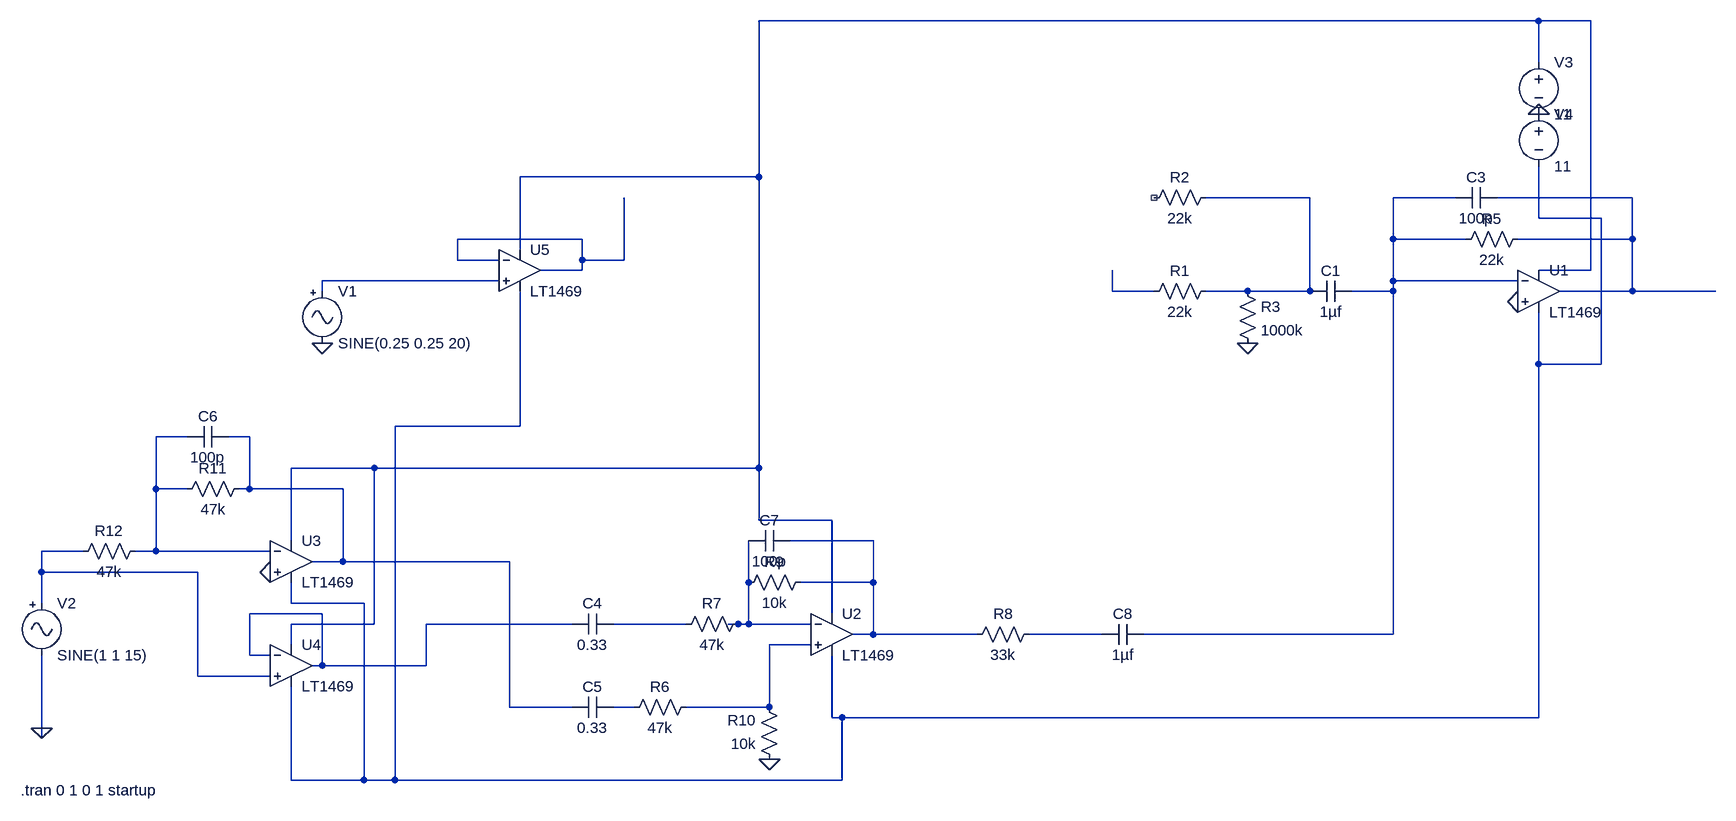
[diagram p0: schematic +++DIFF++++.asc]
+++DIFF++++.asc, the LTspice schematic file:
Version 4
SHEET 1 996 944
WIRE 720 -400 -480 -400
WIRE 800 -400 720 -400
WIRE 720 -336 720 -400
WIRE -480 -160 -480 -400
WIRE -480 -160 -848 -160
WIRE 368 -128 208 -128
WIRE 592 -128 496 -128
WIRE 864 -128 656 -128
WIRE 720 -96 720 -176
WIRE 816 -96 720 -96
WIRE -752 -64 -944 -64
WIRE 496 -64 496 -128
WIRE 608 -64 496 -64
WIRE 864 -64 864 -128
WIRE 864 -64 688 -64
WIRE -848 -48 -848 -160
WIRE -944 -32 -944 -64
WIRE -880 -32 -944 -32
WIRE -752 -32 -752 -64
WIRE -688 -32 -688 -128
WIRE -688 -32 -752 -32
WIRE -752 -16 -752 -32
WIRE -752 -16 -816 -16
WIRE 800 -16 800 -400
WIRE 800 -16 720 -16
WIRE -880 0 -1152 0
WIRE 496 0 496 -64
WIRE 688 0 496 0
WIRE -1152 16 -1152 0
WIRE 64 16 64 -16
WIRE 128 16 64 16
WIRE 272 16 208 16
WIRE 368 16 368 -128
WIRE 368 16 272 16
WIRE 496 16 496 0
WIRE 496 16 432 16
WIRE 864 16 864 -64
WIRE 864 16 752 16
WIRE 992 16 864 16
WIRE 720 128 720 48
WIRE 816 128 816 -96
WIRE 816 128 720 128
WIRE -848 224 -848 16
WIRE -848 224 -1040 224
WIRE -1360 240 -1408 240
WIRE -1264 240 -1296 240
WIRE -1072 288 -1200 288
WIRE -480 288 -480 -160
WIRE -480 288 -1072 288
WIRE -1408 320 -1408 240
WIRE -1360 320 -1408 320
WIRE -1264 320 -1264 240
WIRE -1264 320 -1280 320
WIRE -1120 320 -1264 320
WIRE -480 368 -480 288
WIRE -368 368 -480 368
WIRE -1200 400 -1200 288
WIRE -304 400 -432 400
WIRE -1520 416 -1584 416
WIRE -1408 416 -1408 320
WIRE -1408 416 -1440 416
WIRE -1232 416 -1408 416
WIRE -1120 432 -1120 320
WIRE -1120 432 -1168 432
WIRE -864 432 -1120 432
WIRE -1584 448 -1584 416
WIRE -1344 448 -1584 448
WIRE -496 464 -496 400
WIRE -304 464 -304 400
WIRE -304 464 -416 464
WIRE -1584 496 -1584 448
WIRE -1200 496 -1200 464
WIRE -1088 496 -1200 496
WIRE -1152 512 -1264 512
WIRE -368 512 -368 368
WIRE -1072 528 -1072 288
WIRE -1072 528 -1200 528
WIRE -768 528 -992 528
WIRE -592 528 -704 528
WIRE -512 528 -528 528
WIRE -496 528 -496 464
WIRE -496 528 -512 528
WIRE -400 528 -496 528
WIRE -304 544 -304 464
WIRE -304 544 -336 544
WIRE -144 544 -304 544
WIRE 48 544 -64 544
WIRE 496 544 496 16
WIRE 496 544 112 544
WIRE -1200 560 -1200 528
WIRE -400 560 -464 560
WIRE -1264 576 -1264 512
WIRE -1232 576 -1264 576
WIRE -1152 592 -1152 512
WIRE -1152 592 -1168 592
WIRE -992 592 -992 528
WIRE -992 592 -1152 592
WIRE -1344 608 -1344 448
WIRE -1232 608 -1344 608
WIRE -864 656 -864 432
WIRE -768 656 -864 656
WIRE -672 656 -704 656
WIRE -464 656 -464 560
WIRE -464 656 -592 656
WIRE -368 672 -368 576
WIRE -352 672 -368 672
WIRE 720 672 720 128
WIRE 720 672 -352 672
WIRE -1584 688 -1584 576
WIRE -1584 704 -1584 688
WIRE -1200 768 -1200 624
WIRE -1088 768 -1088 496
WIRE -1088 768 -1200 768
WIRE -1040 768 -1040 224
WIRE -1040 768 -1088 768
WIRE -352 768 -352 672
WIRE -352 768 -1040 768
FLAG 688 32 0
FLAG 720 -256 0
FLAG -1152 96 0
FLAG -464 736 0
FLAG -1584 688 0
FLAG -1232 448 0
FLAG 272 96 0
SYMBOL res 224 0 R90
WINDOW 0 0 56 VBottom 2
WINDOW 3 32 56 VTop 2
SYMATTR InstName R1
SYMATTR Value 22k
SYMBOL Misc\\signal -1152 0 R0
WINDOW 123 0 0 Left 0
WINDOW 39 0 0 Left 0
SYMATTR InstName V1
SYMATTR Value SINE(0.25 0.25 20)
SYMBOL Misc\\signal -1584 480 R0
WINDOW 123 0 0 Left 0
WINDOW 39 0 0 Left 0
SYMATTR InstName V2
SYMATTR Value SINE(1 1 15)
SYMBOL OpAmps\\LT1469 720 -48 R0
SYMATTR InstName U1
SYMBOL voltage 720 -352 R0
WINDOW 123 0 0 Left 0
WINDOW 39 0 0 Left 0
SYMATTR InstName V3
SYMATTR Value 11
SYMBOL voltage 720 -272 R0
WINDOW 123 0 0 Left 0
WINDOW 39 0 0 Left 0
SYMATTR InstName V4
SYMATTR Value 11
SYMBOL res 704 -80 R90
WINDOW 0 0 56 VBottom 2
WINDOW 3 32 56 VTop 2
SYMATTR InstName R5
SYMATTR Value 22k
SYMBOL cap 656 -144 R90
WINDOW 0 0 32 VBottom 2
WINDOW 3 32 32 VTop 2
SYMATTR InstName C3
SYMATTR Value 100p
SYMBOL OpAmps\\LT1469 -368 480 R0
SYMATTR InstName U2
SYMBOL res -48 528 R90
WINDOW 0 0 56 VBottom 2
WINDOW 3 32 56 VTop 2
SYMATTR InstName R8
SYMATTR Value 33k
SYMBOL res -400 448 R90
WINDOW 0 0 56 VBottom 2
WINDOW 3 32 56 VTop 2
SYMATTR InstName R9
SYMATTR Value 10k
SYMBOL res -448 752 R180
WINDOW 0 36 76 Left 2
WINDOW 3 36 40 Left 2
SYMATTR InstName R10
SYMATTR Value 10k
SYMBOL cap -432 384 R90
WINDOW 0 0 32 VBottom 2
WINDOW 3 32 32 VTop 2
SYMATTR InstName C7
SYMATTR Value 100p
SYMBOL res -688 672 R270
WINDOW 0 32 56 VTop 2
WINDOW 3 0 56 VBottom 2
SYMATTR InstName R6
SYMATTR Value 47k
SYMBOL res -608 544 R270
WINDOW 0 32 56 VTop 2
WINDOW 3 0 56 VBottom 2
SYMATTR InstName R7
SYMATTR Value 47k
SYMBOL cap 112 528 R90
WINDOW 0 0 32 VBottom 2
WINDOW 3 32 32 VTop 2
SYMATTR InstName C8
SYMATTR Value 1µf
SYMBOL OpAmps\\LT1469 -1200 368 R0
SYMATTR InstName U3
SYMBOL OpAmps\\LT1469 -1200 528 R0
SYMATTR InstName U4
SYMBOL cap -704 512 R90
WINDOW 0 0 32 VBottom 2
WINDOW 3 32 32 VTop 2
SYMATTR InstName C4
SYMATTR Value 0.33
SYMBOL cap -704 640 R90
WINDOW 0 0 32 VBottom 2
WINDOW 3 32 32 VTop 2
SYMATTR InstName C5
SYMATTR Value 0.33
SYMBOL res -1376 336 R270
WINDOW 0 32 56 VTop 2
WINDOW 3 0 56 VBottom 2
SYMATTR InstName R11
SYMATTR Value 47k
SYMBOL res -1536 432 R270
WINDOW 0 32 56 VTop 2
WINDOW 3 0 56 VBottom 2
SYMATTR InstName R12
SYMATTR Value 47k
SYMBOL cap -1296 224 R90
WINDOW 0 0 32 VBottom 2
WINDOW 3 32 32 VTop 2
SYMATTR InstName C6
SYMATTR Value 100p
SYMBOL OpAmps\\LT1469 -848 -80 R0
SYMATTR InstName U5
SYMBOL cap 432 0 R90
WINDOW 0 0 32 VBottom 2
WINDOW 3 32 32 VTop 2
SYMATTR InstName C1
SYMATTR Value 1µf
SYMBOL res 224 -144 R90
WINDOW 0 0 56 VBottom 2
WINDOW 3 32 56 VTop 2
SYMATTR InstName R2
SYMATTR Value 22k
SYMBOL res 256 0 R0
SYMATTR InstName R3
SYMATTR Value 1000k
TEXT -1616 784 Left 2 !.tran 0 1 0 1 startup

The netlist it stands for:
* +++DIFF++++.asc
R1 N002 N008 22k
V1 N007 0 SINE(0.25 0.25 20)
V2 N012 0 SINE(1 1 15)
XU1 0 N003 N001 N005 N004 LT1469  ; pins In+ In- V+ V- OUT
V3 N001 0 11
V4 0 N005 11
R5 N004 N003 22k
C3 N004 N003 100p
XU2 N017 N013 N001 N005 N011 LT1469  ; pins In+ In- V+ V- OUT
R8 N016 N011 33k
R9 N011 N013 10k
R10 0 N017 10k
C7 N011 N013 100p
R6 N018 N017 47k
R7 N015 N013 47k
C8 N003 N016 1µf
XU3 0 N009 N001 N005 N010 LT1469  ; pins In+ In- V+ V- OUT
XU4 N012 N014 N001 N005 N014 LT1469  ; pins In+ In- V+ V- OUT
C4 N015 N014 0.33
C5 N018 N010 0.33
R11 N009 N010 47k
R12 N012 N009 47k
C6 N010 N009 100p
XU5 N007 N006 N001 N005 N006 LT1469  ; pins In+ In- V+ V- OUT
C1 N003 N002 1µf
R2 N002 NC_01 22k
R3 N002 0 1000k
.tran 0 1 0 1 startup
.backanno
.end